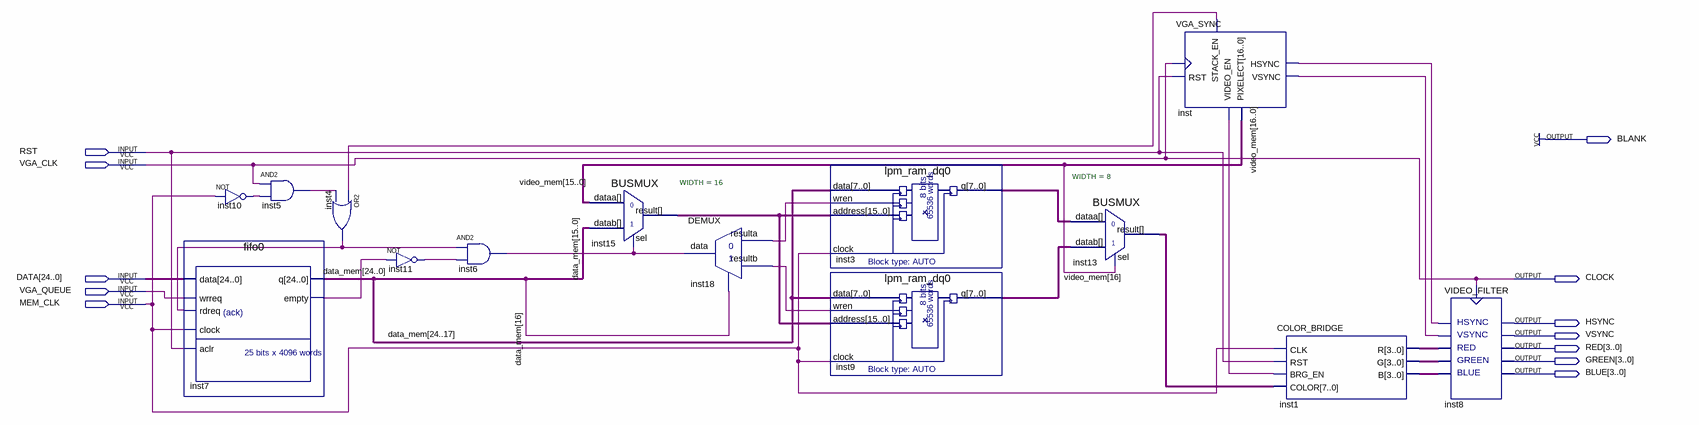
[diagram p0: schematic sheet]
// Quartus schematic VGA_MOD.bdf as structural Verilog: 14 symbols, 12 pins
module VGA_MOD (
  input  RST,
  input  VGA_CLK,
  input  [24:0] DATA,
  input  VGA_QUEUE,
  input  MEM_CLK,
  output BLANK,
  output CLOCK,
  output HSYNC,
  output VSYNC,
  output [3:0] RED,
  output [3:0] GREEN,
  output [3:0] BLUE
);

  wire inst4_out, inst5_out, inst6_out, inst7_empty, inst10_out, inst11_out, inst18_out0, inst18_out1,
       inst_hsync, inst_stack_en, inst_video_en, inst_vsync;
  wire [3:0] inst1_b, inst1_g, inst1_r;
  wire [7:0] inst3_q, inst9_q, inst13_result;
  wire [15:0] inst15_result;
  wire [16:0] video_mem;
  wire [24:0] data_mem;

  fifo0 inst7 (
    .data(DATA), .wrreq(VGA_QUEUE), .rdreq(inst4_out), .clock(MEM_CLK), .aclr(RST), .q(data_mem),
    .empty(inst7_empty));
  not inst10 (inst10_out, MEM_CLK);
  and inst5 (inst5_out, VGA_CLK, inst10_out);
  or inst4 (inst4_out, inst_stack_en, inst5_out);
  not inst11 (inst11_out, inst7_empty);
  and inst6 (inst6_out, inst4_out, inst11_out);
  BUSMUX #(.WIDTH(16)) inst15 (
    .datab(data_mem[15:0]), .sel(inst6_out), .dataa(video_mem[15:0]), .result(inst15_result));
  DEMUX inst18 (.SEL(data_mem[16]), .IN(inst6_out), .OUT0(inst18_out0), .OUT1(inst18_out1));
  lpm_ram_dq0 inst3 (.data(data_mem[24:17]), .wren(inst18_out0), .address(inst15_result), .clock(MEM_CLK), .q(inst3_q));
  lpm_ram_dq0 inst9 (.data(data_mem[24:17]), .wren(inst18_out1), .address(inst15_result), .clock(MEM_CLK), .q(inst9_q));
  BUSMUX #(.WIDTH(8)) inst13 (.datab(inst9_q), .sel(video_mem[16]), .dataa(inst3_q), .result(inst13_result));
  VGA_SYNC inst (
    .RST(RST), .CLK(VGA_CLK), .PIXELECT(video_mem), .HSYNC(inst_hsync), .VSYNC(inst_vsync),
    .VIDEO_EN(inst_video_en), .STACK_EN(inst_stack_en));
  COLOR_BRIDGE inst1 (
    .CLK(MEM_CLK), .RST(RST), .BRG_EN(inst_video_en), .COLOR(inst13_result), .R(inst1_r), .G(inst1_g),
    .B(inst1_b));
  VIDEO_FILTER inst8 (
    .CLK(VGA_CLK), .iHSYNC(inst_hsync), .iVSYNC(inst_vsync), .iR(inst1_r), .iG(inst1_g), .iB(inst1_b),
    .oHSYNC(HSYNC), .oVSYNC(VSYNC), .oR(RED), .oG(GREEN), .oB(BLUE));

  assign BLANK = 1'b1;
  assign CLOCK = VGA_CLK;
endmodule
